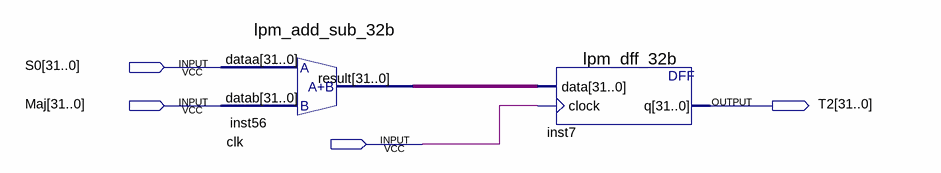
[diagram p0: schematic sheet]
// Quartus schematic T2.bdf as structural Verilog: 2 symbols, 4 pins
module T2 (
  input  [31:0] S0,
  input  [31:0] Maj,
  input  clk,
  output [31:0] T2
);

  wire [31:0] inst56_result;

  lpm_add_sub_32b inst56 (.dataa(S0), .datab(Maj), .result(inst56_result));
  lpm_dff_32b inst7 (.data(inst56_result), .clock(clk), .q(T2));
endmodule
